# Altium project BOOST_Project.PrjPcb
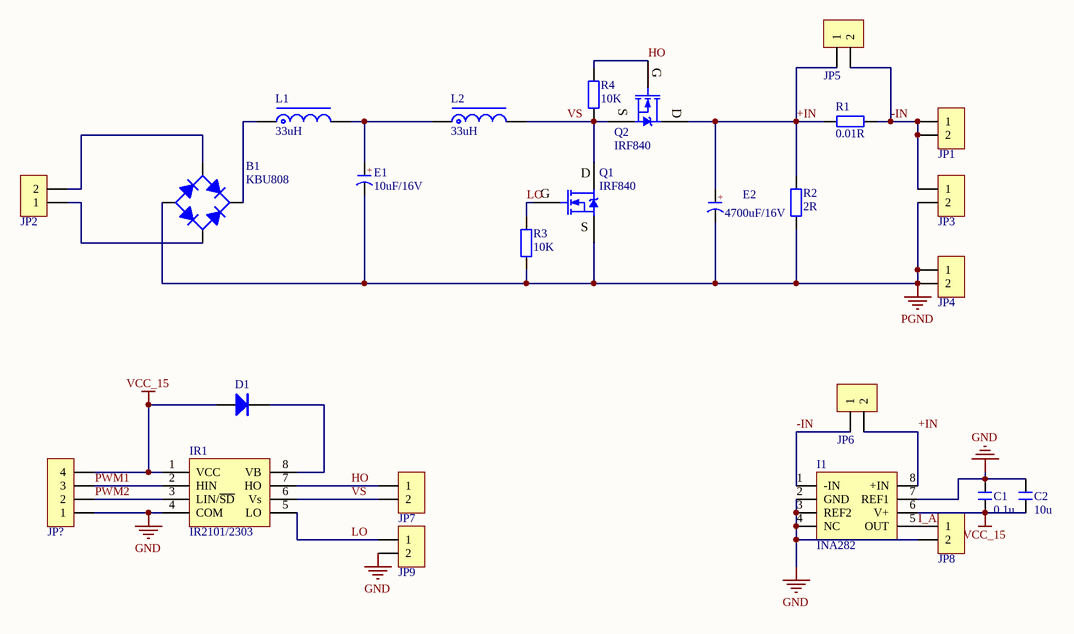
[diagram p0: BOOST电路.SchDoc]
1 sheet, 26 parts. Net scope: global (net labels, ports and power ports of the same name join across sheets).
Board file: BOOST_PCB1.PcbDoc

## Sheet BOOST电路.SchDoc
size A4

### Parts
B1  KBU808  [KBU]
C1  0.1u  [C 0603_M]
C2  10u  [C 0603_M]
D1  1N4007  [DO-41]  (value not drawn)
E1  10uF/16V  [CAP 7.5*16*25 - BK]
E2  4700uF/16V  [CAP 7.5*16*25 - BK]
I1  INA282  [SOP8_M]
IR1  IR2101/2303  [SOP8W_M]
JP1  HDR-1X2  [HDR2.54-LI-2P]  (value not drawn)
JP2  HDR-1X2  [KF2EDGK5.08-LI-2P]  (value not drawn)
JP3  HDR-1X2  [KF2EDGK5.08-LI-2P]  (value not drawn)
JP4  HDR-1X2  [HDR2.54-LI-2P]  (value not drawn)
JP5  HDR-1X2  [HDR2.54-LI-2P]  (value not drawn)
JP6  HDR-1X2  [HDR2.54-LI-2P]  (value not drawn)
JP7  HDR-1X2  [HDR2.54-LI-2P]  (value not drawn)
JP8  HDR-1X2  [HDR2.54-LI-2P]  (value not drawn)
JP9  HDR-1X2  [HDR2.54-LI-2P]  (value not drawn)
JP?  HDR-1X4  [HDR2.54-LI-4P]  (value not drawn)
L1  33uH  [KF2EDGK5.0-LI-2P]
L2  33uH  [KF2EDGK5.0-LI-2P]
Q1  IRF840  [KF128-3.81-3P]
Q2  IRF840  [KF128-3.81-3P]
R1  0.01R  [RX10-18*15*5]
R2  2R  [RX10-18*15*5]
R3  10K  [R 0603_L]
R4  10K  [R 0603_L]

### Nets
GND: C1.2 C2.2 I1.2(GND) I1.3(REF2) I1.4(NC) I1.7(REF1) IR1.4(COM) JP8.2 JP9.2 JP?.1
PGND: B1.DC- E1.2(K) E2.2(K) JP3.2 JP4.1 JP4.2 Q1.3(S) R2.1 R3.1
VCC_15: C1.1 C2.1 D1.1(A) I1.6(V+) IR1.1(VCC) JP?.4
+IN: E2.1(A) I1.8(+IN) JP5.1 JP6.2 Q2.2(D) R1.2 R2.2
-IN: I1.1(-IN) JP1.1 JP1.2 JP3.1 JP5.2 JP6.1 R1.1
HO: IR1.7(HO) JP7.1 Q2.1(G) R4.2
I_ADC: I1.5(OUT) JP8.1
LO: IR1.5(LO) JP9.1 Q1.1(G) R3.2
PWM1: IR1.2(HIN) JP?.3
PWM2: IR1.3(LIN/~{SD}) JP?.2
VS: IR1.6(Vs) JP7.2 L2.2 Q1.2(D) Q2.3(S) R4.1
NetB1_AC1: B1.AC1 JP2.2
NetB1_AC2: B1.AC2 JP2.1
NetB1_DC+: B1.DC+ L1.1
NetD1_2: D1.2(K) IR1.8(VB)
NetE1_1: E1.1(A) L1.2 L2.1

### Notes on the sheet
- (in symbol C-CAP) +

### Library data of the parts
B1 = KBU: 800V/8A整流桥; BOM名称: 1KV/2A整流桥; 版权归属: 源创客; 学习资源: www.ooocke.com
C1 C2 = C: 无极性贴片电容; 版权归属: 源创客; BOM名称: 无极性贴片电容; 学习资源: www.ooocke.com
D1 = 1N4007: 整流二极管; 版权归属: 源创客; BOM名称: 整流二极管; 学习资源: www.ooocke.com
E1 E2 = C-CAP: 直插电解电容; 版权归属: 源创客; BOM名称: 直插电解电容; 学习资源: www.ooocke.com
JP1-JP9 = Header 2: 2P接插件; 版权归属: 源创客; BOM名称: 2P接插件; 学习资源: www.ooocke.com
JP? = Header 4: 4P接插件; 版权归属: 源创客; BOM名称: 4P接插件; 学习资源: www.ooocke.com
L1 L2 = L-MR: 功率磁环电感; 版权归属: 源创客; BOM名称: 功率磁环电感; 学习资源: www.ooocke.com
Q1 Q2 = IRF840: N沟场效应管; 版权归属: 源创客; BOM名称: N沟场效应管; 学习资源: www.ooocke.com
R1 R2 = RX: 大功率电阻; 版权归属: 源创客; BOM名称: 大功率电阻; 学习资源: www.ooocke.com
R3 R4 = R: 贴片电阻; 版权归属: 源创客; BOM名称: 贴片电阻; 学习资源: www.ooocke.com